# EAGLE design rapidshark-display-shifter-mk-2.2-fab (EAGLE 6.5.0)
AUTHOR: sean@yak.net
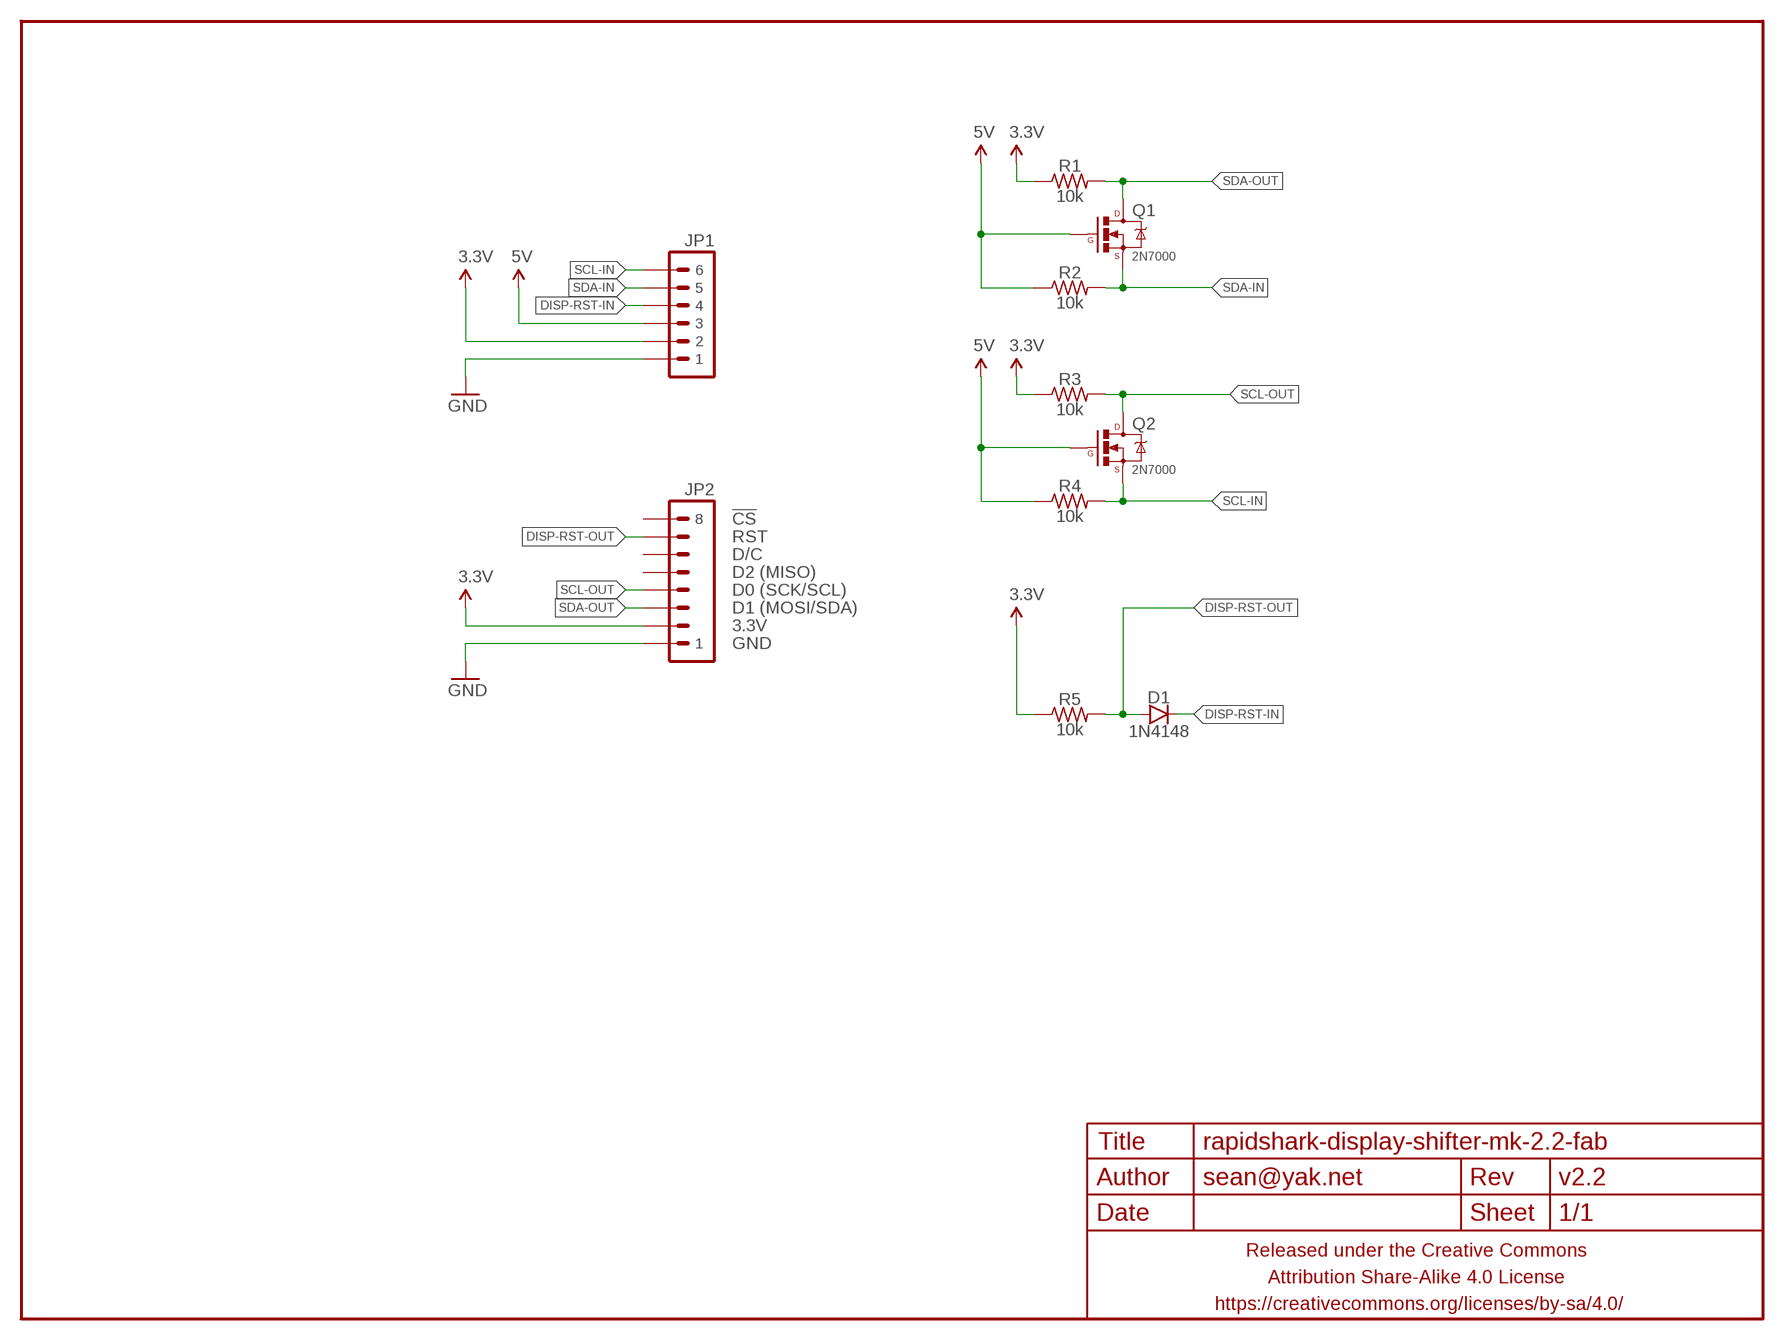
[diagram p0: schematic, sheet 1]

## Parts
D1  1N4148  DIODEPTH-7.62MM  [DIODE-7.62MM]
FRAME1  FRAME-LETTERNO_PACKAGE  [DUMMY]
JP1  M06JST-PH-PTH-VERT  [JST-6-PH-VERT-PTH]
JP2  M08PTH-1.2MMHOLES  [1X08-1.2MMHOLES]
Q1  2N7000  MOSFET-NCHANNEL2N7000-AMMO  [TO-92-AMMO]
Q2  2N7000  MOSFET-NCHANNEL2N7000-AMMO  [TO-92-AMMO]
R1  10k  RESISTORPTH-AXIAL-5.08MM  [RESISTOR-AXIAL-PTH-5.08MM]
R2  10k  RESISTORPTH-AXIAL-5.08MM  [RESISTOR-AXIAL-PTH-5.08MM]
R3  10k  RESISTORPTH-AXIAL-5.08MM  [RESISTOR-AXIAL-PTH-5.08MM]
R4  10k  RESISTORPTH-AXIAL-5.08MM  [RESISTOR-AXIAL-PTH-5.08MM]
R5  10k  RESISTORPTH-AXIAL-5.08MM  [RESISTOR-AXIAL-PTH-5.08MM]

## Nets
3.3V: JP1.2 JP2.2 R1.P$1 R3.P$1 R5.P$1
5V: JP1.3 Q1.2(G) Q2.2(G) R2.P$1 R4.P$1
DISP-RST-IN: D1.K(C) JP1.4
DISP-RST-OUT: D1.A JP2.7 R5.P$2
GND: JP1.1 JP2.1
SCL-IN: JP1.6 Q2.1(S) R4.P$2
SCL-OUT: JP2.4 Q2.3(D) R3.P$2
SDA-IN: JP1.5 Q1.1(S) R2.P$2
SDA-OUT: JP2.3 Q1.3(D) R1.P$2
Unconnected: JP2.5 JP2.6 JP2.8

## Notes on the sheet
- !CS
- RST
- D/C
- D2 (MISO)
- D0 (SCK/SCL)
- D1 (MOSI/SDA)
- 3.3V
- GND

## Library data of the parts
D1 = A_butts:DIODE: Diode These are standard reverse protection diodes and small signal diodes. SMA package can handle up to about 1A. SOD-323 can handle about 200mA. What the SOD-323 package when ordering, there are some mfgs out there that are 5-pin packages.
FRAME1 = A_butts:FRAME-LETTER: Schematic Frame Standard 8.5x11 US Letter frame; DESIGNER: sean@yak.net; VERSION: v2.2
JP1 = A_butts:M06: Header 6 Standard 6-pin 0.1" header. Use with straight break away headers (SKU : PRT-00116), right angle break away headers (PRT-00553), swiss pins (PRT-00743), machine pins (PRT-00117), and female headers (PRT-00115). Molex polarized connector foot print use with SKU : PRT-08094 with associated crimp pins and housings. NOTES ON THE VARIANTS LOCK and LOCK_LONGPADS... This footprint was designed to help hold the alignment of a through-hole component (i.e. 6-pin header) while soldering it into place. You may notice that each hole has been shifted either up or down by 0.005 of an inch from it's more standard position (which is a perfectly straight line). This slight alteration caused the pins (the squares in the middle) to touch the edges of the holes. Because they are alternating, it causes a "brace" to hold the component in place. 0.005 has proven to be the perfect amount of "off-center" position when using our standard breakaway headers. Although looks a little odd when you look at the bare footprint, once you have a header in there, the alteration is very hard to notice. Also,if you push a header all the way into place, it is covered up entirely on the bottom side. This idea of altering the position of holes to aid alignment will be further integrated into the Sparkfun Library for other footprints. It can help hold any component with 3 or more connection pins.
JP2 = A_butts:M08: Header 8 Standard 8-pin 0.1" header. Use with straight break away headers (SKU : PRT-00116), right angle break away headers (PRT-00553), swiss pins (PRT-00743), machine pins (PRT-00117), and female headers (PRT-00115).
Q1 Q2 = A_butts:MOSFET-NCHANNEL: Common NMOSFET Parts MFG P/N Store ID Prod ID FDD8780 TRANS-09984 SI7820DN TRANS-11055 FDS6630A IC-08089 2N7002PW TRANS-11151 FQP30N06L COM-10213 TRANS-10060 BSS123LT1G TRANS-08345 BSS138 TRANS-00830 BS170 2N7000
R1-R5 = A_butts:RESISTOR: RESISTOR, American symbol

## Board
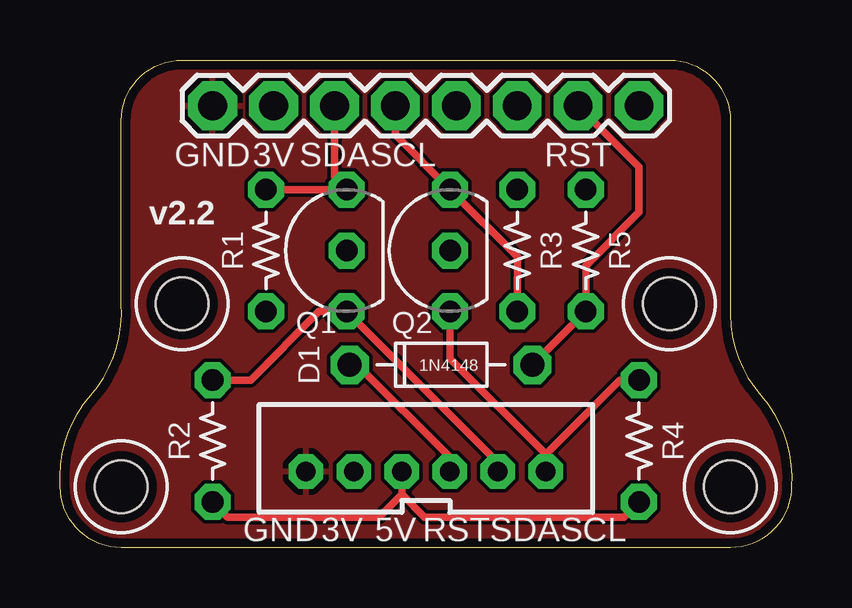
[diagram p1: board, top side]
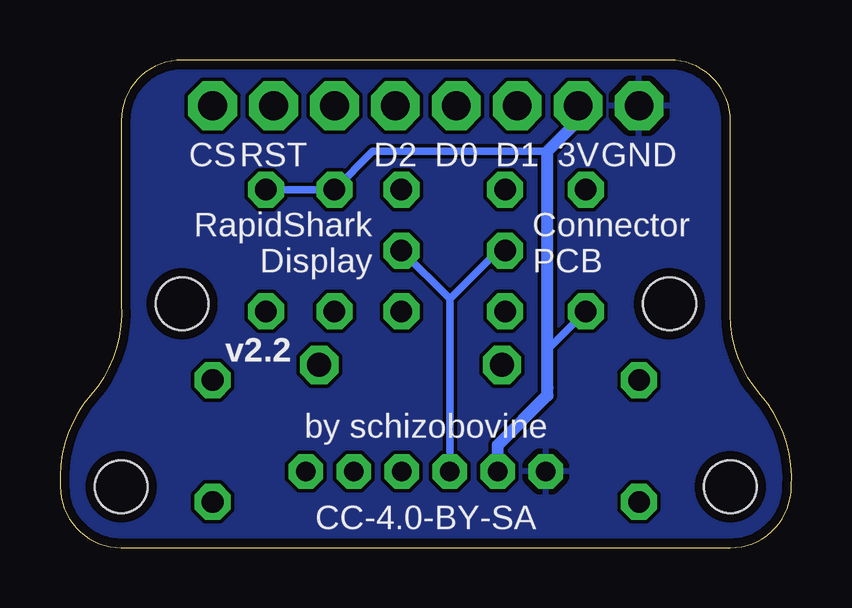
[diagram p2: board, bottom side, seen from below]

Size 30.51 x 20.32 mm. Coordinates in mm from the lower left corner, seen from the top.
Outline: 2.55,10.16 2.55,17.78 arc-90 5.09,20.32 25.41,20.32 arc-90 27.95,17.78 27.95,10.16 arc45 29.22,6.35 arc-45 30.49,2.54 arc-90 27.95,0 2.55,0 arc-90 0.01,2.54 arc-45 1.28,6.35 arc45 2.55,10.16
Copper layers (1*16): Top 0.0356mm / dielectric 1.5011mm / Bottom 0.0356mm
Design rules "LaenPCBOrder_2": minimum track width 6mil, minimum drill 13mil, track to track 6mil, track to pad 6mil, pad to pad 6mil, via to via 6mil, smd to smd 6mil, copper to edge 15mil, drill to drill 6mil, minimum pad ring 7mil, minimum via ring 7mil, stop-mask expansion 3mil, vias tented up to drill 20mil, thermal gap 10mil
Holes 2.2 mm at 27.95,2.54 2.55,2.54 5.09,10.16 25.41,10.16

### Footprints (pad centres in the part's own frame; a part is rotated, then mirrored left to right if it is on the bottom)
DIODE-7.62MM = drill 1 pad 1.6 octagon: A -3.81,0; K 3.81,0
JST-6-PH-VERT-PTH = drill 0.8 pad 1.422 octagon: 1 -5,0; 2 -3,0; 3 -1,0; 4 1,0; 5 3,0; 6 5,0
1X08-1.2MMHOLES = drill 1.2 pad 2.032 octagon: 1 0,0; 2 2.54,0; 3 5.08,0; 4 7.62,0; 5 10.16,0; 6 12.7,0; 7 15.24,0; 8 17.78,0
TO-92-AMMO = drill 0.9 pad 1.5 octagon: 1 -2.54,0; 2 0,0; 3 2.54,0
RESISTOR-AXIAL-PTH-5.08MM = drill 0.9 pad 1.5 octagon: P$1 -2.54,0; P$2 2.54,0

### Placement (x,y rotation side)
D1  15.89,7.62 180 top
FRAME1  0.01,0 270 bottom
JP1  15.25,3.17 0 top
JP2  6.36,18.41 0 top
Q1  11.95,12.38 90 top
Q2  16.27,12.38 90 top
R1  8.59,12.38 90 top
R2  6.36,4.45 90 top
R3  19.06,12.38 270 top
R4  24.14,4.45 90 top
R5  21.92,12.38 270 top

### Tracks (layer width: path | path; a pad name or v marks a point on that pad's centre or on a via)
3.3V
  Bottom 0.305: R1.P$1 10.17,8.26 10.17,6.67 | 10.17,16.51 17.47,16.51 R3.P$1 R5.P$1
  Bottom 0.508: JP1.2 12.25,4.27 10.17,6.35 10.17,6.67 10.17,16.51 8.9,17.78 JP2.2
5V
  Top 0.305: R2.P$1 7,1.27 13.3,1.27 14.25,2.22 | JP1.3 14.25,2.22 | R4.P$1 23.51,1.27 15.21,1.27 14.25,2.22
  Bottom 0.305: JP1.3 14.25,10.37 | 14.25,10.37 Q2.2 | Q1.2 12.24,12.38 14.25,10.37
DISP-RST-IN
  Top 0.305: JP1.4 16.25,3.76 12.4,7.62 D1.K
DISP-RST-OUT
  Top 0.305: D1.A R5.P$2 21.92,11.75 24.14,13.97 24.14,15.88 JP2.7
GND
  pour Top (rank 6): 2.55,10.16 2.55,17.78 arc-90 5.09,20.32 25.41,20.32 arc-90 27.95,17.78 27.95,10.16 arc45 29.22,6.35 arc-45 30.49,2.54 arc-90 27.95,0 2.55,0 arc-90 0.01,2.54 arc-45 1.28,6.35 arc45
  pour Bottom (rank 6): 2.55,10.16 2.55,17.78 arc-90 5.09,20.32 25.41,20.32 arc-90 27.95,17.78 27.95,10.16 arc45 29.22,6.35 arc-45 30.49,2.54 arc-90 27.95,0 2.55,0 arc-90 0.01,2.54 arc-45 1.28,6.35 arc45
SCL-IN
  Top 0.305: JP1.6 20.25,3.89 | 20.25,3.89 16.27,7.87 Q2.1 | 20.25,3.89 23.35,6.99 R4.P$2
SCL-OUT
  Top 0.305: JP2.4 13.98,17.21 Q2.3 19.06,12.13 R3.P$2
SDA-IN
  Top 0.305: JP1.5 18.25,3.54 Q1.1 10.81,9.84 7.95,6.99 R2.P$2
SDA-OUT
  Top 0.305: R1.P$2 Q1.3 11.44,15.43 JP2.3

### Text on the board
tPlace: GND | 3V | SDA | SCL | RST | GND | 3V | 5V | RST | SDA | SCL
bPlace: GND | 3V | D1 | D0 | D2 | RST | CS | Connector / PCB | RapidShark / Display | by schizobovine | CC-4.0-BY-SA